# Altium schematic sheet logic_conn.SchDoc: mcHF Pro Transceiver UI board
size A3; Author: Krassi Atanassov; CompanyName: MØNKA; Engineer: For radio amateurs experimentation, non-commercial use only. Thank you!; Revision: 0.8.2; SheetTotal: 18
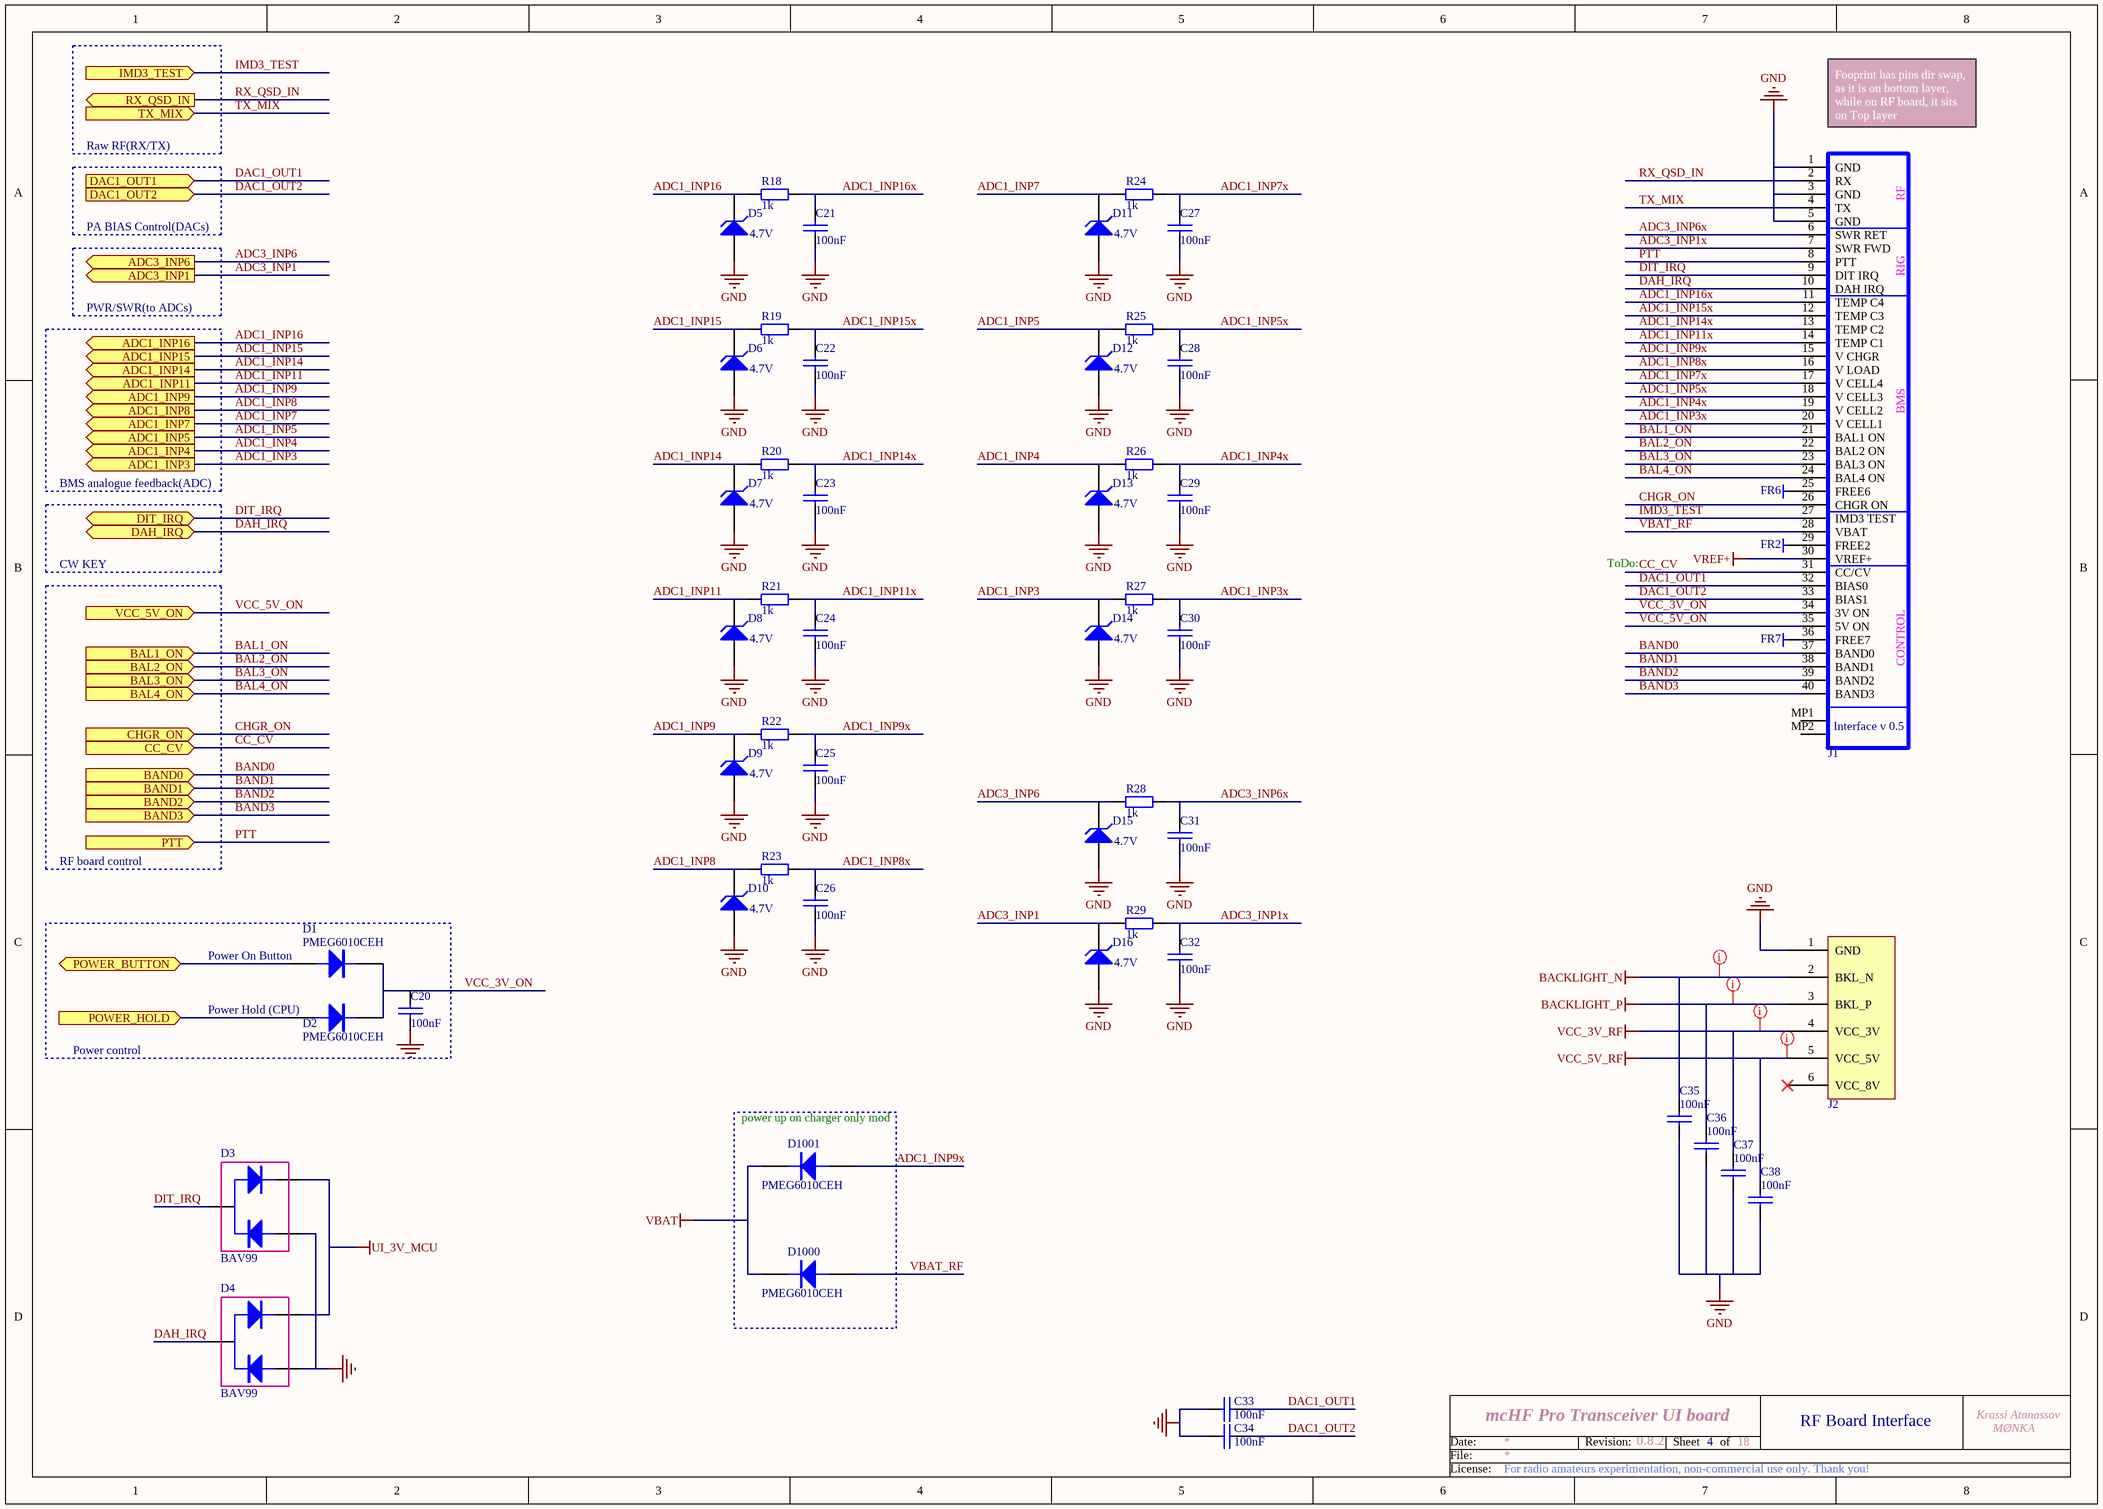
[diagram p0: logic_conn.SchDoc]

## Parts
C20  100nF  [0805]
C21  100nF  [0805]
C22  100nF  [0805]
C23  100nF  [0805]
C24  100nF  [0805]
C25  100nF  [0805]
C26  100nF  [0805]
C27  100nF  [0805]
C28  100nF  [0805]
C29  100nF  [0805]
C30  100nF  [0805]
C31  100nF  [0805]
C32  100nF  [0805]
C33  100nF  [0805]
C34  100nF  [0805]
C35  100nF  [0805]
C36  100nF  [0805]
C37  100nF  [0805]
C38  100nF  [0805]
D1  PMEG6010CEH  [SOD87]
D2  PMEG6010CEH  [SOD87]
D3  BAV99  [SOT-23]
D4  BAV99  [SOT-23]
D5  4.7V  [0805P]
D6  4.7V  [0805P]
D7  4.7V  [0805P]
D8  4.7V  [0805P]
D9  4.7V  [0805P]
D10  4.7V  [0805P]
D11  4.7V  [0805P]
D12  4.7V  [0805P]
D13  4.7V  [0805P]
D14  4.7V  [0805P]
D15  4.7V  [0805P]
D16  4.7V  [0805P]
D1000  PMEG6010CEH  [SOD87]
D1001  PMEG6010CEH  [SOD87]
FR2  TP  [tp]  (value not drawn)  (no BOM)
FR6  TP  [tp]  (value not drawn)  (no BOM)
FR7  TP  [tp]  (value not drawn)  (no BOM)
J1  INT V 0.5  [MOLX-54132-4033r]  (value not drawn)
J2  PWR6  [HDR_1x6_PWR_R]  (value not drawn)
R18  1k  [0805]
R19  1k  [0805]
R20  1k  [0805]
R21  1k  [0805]
R22  1k  [0805]
R23  1k  [0805]
R24  1k  [0805]
R25  1k  [0805]
R26  1k  [0805]
R27  1k  [0805]
R28  1k  [0805]
R29  1k  [0805]

## Blocks framed on the sheet
power up on charger only mod: D1000 D1001

## Ports
ADC1_INP3 (out), ADC1_INP4 (out), ADC1_INP5 (out), ADC1_INP7 (out), ADC1_INP8 (out), ADC1_INP9 (out), ADC1_INP11 (out), ADC1_INP14 (out), ADC1_INP15 (out), ADC1_INP16 (out), ADC3_INP1 (out), ADC3_INP6 (out), BAL1_ON (in), BAL2_ON (in), BAL3_ON (in), BAL4_ON (in), BAND0 (in), BAND1 (in), BAND2 (in), BAND3 (in), CC_CV (in), CHGR_ON (in), DAC1_OUT1 (in), DAC1_OUT2 (in), DAH_IRQ (bidir), DIT_IRQ (bidir), IMD3_TEST (in), POWER_BUTTON (bidir), POWER_HOLD (in), PTT (in), RX_QSD_IN (out), TX_MIX (in), VCC_5V_ON (in)

## Nets
BACKLIGHT_N: C35.2 J2.2(BKL_N)
BACKLIGHT_P: C36.2 J2.3(BKL_P)
GND: C20.1 C21.1 C22.1 C23.1 C24.1 C25.1 C26.1 C27.1 C28.1 C29.1 C30.1 C31.1 C32.1 C33.2 C34.2 C35.1 C36.1 C37.1 C38.1 D3.1(A1) D4.1(A1) D5.1(A) D6.1(A) D7.1(A) D8.1(A) D9.1(A) D10.1(A) D11.1(A) D12.1(A) D13.1(A) D14.1(A) D15.1(A) D16.1(A) J1.1(GND) J1.3(GND) J1.5(GND) J2.1(GND)
UI_3V_MCU: D3.2(K1) D4.2(K1)
VBAT: D1000.2(K) D1001.2(K)
VCC_3V_RF: C37.2 J2.4(VCC_3V)
VCC_5V_RF: C38.2 J2.5(VCC_5V)
VREF+: J1.30(VREF+)
ADC1_INP3: D14.2(K) R27.2 ; port ADC1_INP3
ADC1_INP3x: C30.2 J1.20(V_CELL1) R27.1
ADC1_INP4: D13.2(K) R26.2 ; port ADC1_INP4
ADC1_INP4x: C29.2 J1.19(V_CELL2) R26.1
ADC1_INP5: D12.2(K) R25.2 ; port ADC1_INP5
ADC1_INP5x: C28.2 J1.18(V_CELL3) R25.1
ADC1_INP7: D11.2(K) R24.2 ; port ADC1_INP7
ADC1_INP7x: C27.2 J1.17(V_CELL4) R24.1
ADC1_INP8: D10.2(K) R23.2 ; port ADC1_INP8
ADC1_INP8x: C26.2 J1.16(V_LOAD) R23.1
ADC1_INP9: D9.2(K) R22.2 ; port ADC1_INP9
ADC1_INP9x: C25.2 D1001.1(A) J1.15(V_CHGR) R22.1
ADC1_INP11: D8.2(K) R21.2 ; port ADC1_INP11
ADC1_INP11x: C24.2 J1.14(TEMP_C1) R21.1
ADC1_INP14: D7.2(K) R20.2 ; port ADC1_INP14
ADC1_INP14x: C23.2 J1.13(TEMP_C2) R20.1
ADC1_INP15: D6.2(K) R19.2 ; port ADC1_INP15
ADC1_INP15x: C22.2 J1.12(TEMP_C3) R19.1
ADC1_INP16: D5.2(K) R18.2 ; port ADC1_INP16
ADC1_INP16x: C21.2 J1.11(TEMP_C4) R18.1
ADC3_INP1: D16.2(K) R29.2 ; port ADC3_INP1
ADC3_INP1x: C32.2 J1.7(SWR_FWD) R29.1
ADC3_INP6: D15.2(K) R28.2 ; port ADC3_INP6
ADC3_INP6x: C31.2 J1.6(SWR_RET) R28.1
BAL1_ON: J1.21(BAL1_ON) ; port BAL1_ON
BAL2_ON: J1.22(BAL2_ON) ; port BAL2_ON
BAL3_ON: J1.23(BAL3_ON) ; port BAL3_ON
BAL4_ON: J1.24(BAL4_ON) ; port BAL4_ON
BAND0: J1.37(BAND0) ; port BAND0
BAND1: J1.38(BAND1) ; port BAND1
BAND2: J1.39(BAND2) ; port BAND2
BAND3: J1.40(BAND3) ; port BAND3
CC_CV: J1.31(CC/CV) ; port CC_CV
CHGR_ON: J1.26(CHGR_ON) ; port CHGR_ON
DAC1_OUT1: C33.1 J1.32(BIAS0) ; port DAC1_OUT1
DAC1_OUT2: C34.1 J1.33(BIAS1) ; port DAC1_OUT2
DAH_IRQ: D4.3(C) J1.10(DAH_IRQ) ; port DAH_IRQ
DIT_IRQ: D3.3(C) J1.9(DIT_IRQ) ; port DIT_IRQ
IMD3_TEST: J1.27(IMD3_TEST) ; port IMD3_TEST
POWER_BUTTON: D1.1(A) ; port POWER_BUTTON
POWER_HOLD: D2.1(A) ; port POWER_HOLD
PTT: J1.8(PTT) ; port PTT
RX_QSD_IN: J1.2(RX) ; port RX_QSD_IN
TX_MIX: J1.4(TX) ; port TX_MIX
VBAT_RF: D1000.1(A) J1.28(VBAT)
VCC_3V_ON: C20.2 D1.2(K) D2.2(K) J1.34(3V_ON)
VCC_5V_ON: J1.35(5V_ON) ; port VCC_5V_ON
NetFR2_1: FR2.1 J1.29(FREE2)
NetFR6_1: FR6.1 J1.25(FREE6)
NetFR7_1: FR7.1 J1.36(FREE7)

Not connected (* = marked no-connect by the designer): J1 MP1 MP2; J2 6(VCC_8V)*

## Layout directives
rule Width Constraint [Pref Width = 12mil    Min Width = 12mil    Max Width = 12mil]: BACKLIGHT_N, BACKLIGHT_P, VCC_3V_RF, VCC_5V_RF

## Notes on the sheet
- Raw RF(RX/TX)
- (near J1) Fooprint has pins dir swap, as it is on bottom layer, while on RF board, it sits on Top layer
- PA BIAS Control(DACs)
- PWR/SWR(to ADCs)
- BMS analogue feedback(ADC)
- CW KEY
- ToDo:
- RF board control
- (near D1) Power On Button
- Power control
- (near D2) Power Hold (CPU)
- 4
- RF Board Interface
- Date:
- File:
- Revision:
- Sheet
- of
- License:
- (in symbol PCB40_FLAT) RF; RIG; BMS; CONTROL; Interface v 0.5

## Library data of the parts
C20-C38 = CAP: Capacitor; Order: FN 252-2090; QT Order: QCC-00154; Price: 0.068
D1 D2 D1000 D1001 = PMEG6010CEH: DIODE, SCHOTTKY, 1A, 60V, SOD-123F; QT Order: QCD-00034; Price: 0.085
D3 = BAV99: Small Signal Diode, Dual Series; Order: FN 162-1837; QT Order: QCD-00039; Price: 0.0618
D4 = BAV99: Small Signal Diode, Dual Series; Order: FN 162-1837; Price: 0.0618
D5 = D Zener: Zener Diode; Notes: Generic 2pin zener in 0805V; Voltage: 4.5V - 5V; Published: 8-Jun-2000; LatestRevisionDate: 17-Jul-2002; LatestRevisionNote: Re-released for DXP Platform.; PackageReference: DIODE-0.7; Publisher: Altium Limited; PackageDescription: Diode, Thru-Hole; 2 Leads; 0.7 in Pin Spacing
D6-D16 = D Zener: Zener Diode; Published: 8-Jun-2000; LatestRevisionDate: 17-Jul-2002; LatestRevisionNote: Re-released for DXP Platform.; PackageReference: DIODE-0.7; Publisher: Altium Limited; PackageDescription: Diode, Thru-Hole; 2 Leads; 0.7 in Pin Spacing
FR2 FR6 FR7 = TP: Test point
J1 = PCB40_FLAT: 40 pin FPC Flat cable connector, board to board
J2 = PWR6: Power connector; Notes: Japan style 6pin 2.54mm pitch, right angle PCB connector
R18-R29 = RES: Resistor; Order: FN 146-9899; QT Order: QCR-00309; Price: 0.023